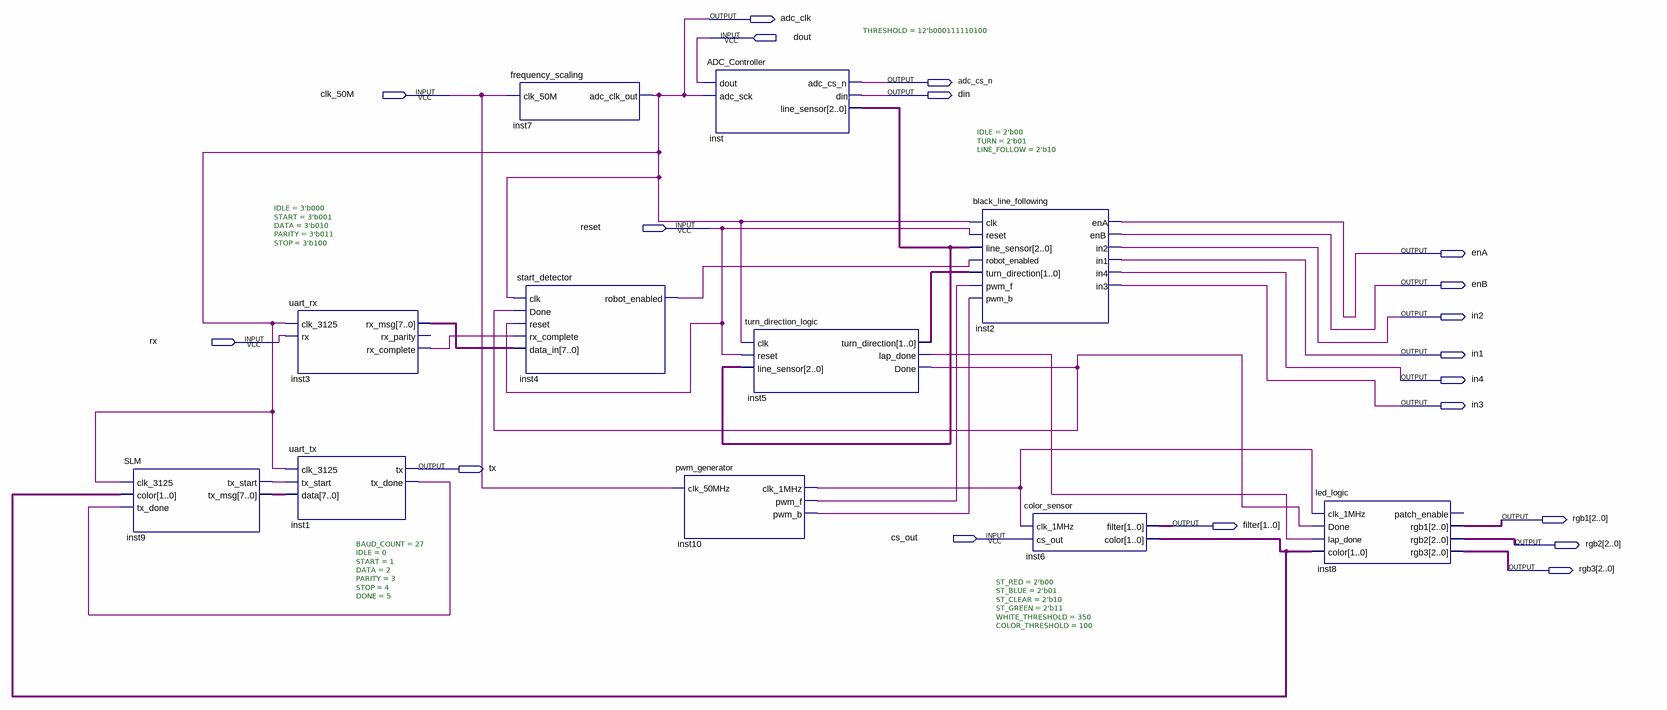
[diagram p0: schematic sheet]
// Quartus schematic top_module.bdf as structural Verilog: 11 symbols, 19 pins
module top_module (
  input  dout,
  input  clk_50M,
  input  reset,
  input  rx,
  input  cs_out,
  output adc_clk,
  output adc_cs_n,
  output din,
  output enA,
  output enB,
  output in2,
  output in1,
  output in4,
  output in3,
  output tx,
  output [2:0] rgb1,
  output [1:0] filter,
  output [2:0] rgb2,
  output [2:0] rgb3
);

  wire inst1_tx_done, inst3_rx_complete, inst4_robot_enabled, inst5_done, inst5_lap_done, inst9_tx_start,
       inst10_clk_1mhz, inst10_pwm_b, inst10_pwm_f;
  wire [1:0] inst5_turn_direction, inst6_color;
  wire [2:0] inst_line_sensor;
  wire [7:0] inst3_rx_msg, inst9_tx_msg;

  SLM inst9 (
    .clk_3125(adc_clk), .color(inst6_color), .tx_done(inst1_tx_done), .tx_start(inst9_tx_start),
    .tx_msg(inst9_tx_msg));
  uart_rx #(.IDLE(3'b000), .START(3'b001), .DATA(3'b010), .PARITY(3'b011), .STOP(3'b100)) inst3 (
    .clk_3125(adc_clk), .rx(rx), .rx_msg(inst3_rx_msg), .rx_complete(inst3_rx_complete));  // open: rx_parity
  uart_tx #(.BAUD_COUNT(27), .IDLE(0), .START(1), .DATA(2), .PARITY(3), .STOP(4), .DONE(5)) inst1 (
    .clk_3125(adc_clk), .tx_start(inst9_tx_start), .data(inst9_tx_msg), .tx(tx), .tx_done(inst1_tx_done));
  frequency_scaling inst7 (.clk_50M(clk_50M), .adc_clk_out(adc_clk));
  start_detector inst4 (
    .clk(adc_clk), .Done(inst5_done), .reset(reset), .rx_complete(inst3_rx_complete), .data_in(inst3_rx_msg),
    .robot_enabled(inst4_robot_enabled));
  pwm_generator inst10 (.clk_50MHz(clk_50M), .clk_1MHz(inst10_clk_1mhz), .pwm_f(inst10_pwm_f), .pwm_b(inst10_pwm_b));
  ADC_Controller #(.THRESHOLD(12'b000111110100)) inst (
    .dout(dout), .adc_sck(adc_clk), .adc_cs_n(adc_cs_n), .din(din), .line_sensor(inst_line_sensor));
  turn_direction_logic inst5 (
    .clk(adc_clk), .reset(reset), .line_sensor(inst_line_sensor), .turn_direction(inst5_turn_direction),
    .lap_done(inst5_lap_done), .Done(inst5_done));
  black_line_following #(.IDLE(2'b00), .TURN(2'b01), .LINE_FOLLOW(2'b10)) inst2 (
    .clk(adc_clk), .reset(reset), .line_sensor(inst_line_sensor), .robot_enabled(inst4_robot_enabled),
    .turn_direction(inst5_turn_direction), .pwm_f(inst10_pwm_f), .pwm_b(inst10_pwm_b), .enA(enA), .enB(enB),
    .in2(in2), .in1(in1), .in4(in4), .in3(in3));
  color_sensor #(.ST_RED(2'b00), .ST_BLUE(2'b01), .ST_CLEAR(2'b10), .ST_GREEN(2'b11), .WHITE_THRESHOLD(350), .COLOR_THRESHOLD(100)) inst6 (
    .clk_1MHz(inst10_clk_1mhz), .cs_out(cs_out), .filter(filter), .color(inst6_color));
  led_logic inst8 (
    .clk_1MHz(inst10_clk_1mhz), .Done(inst5_done), .lap_done(inst5_lap_done), .color(inst6_color),
    .rgb1(rgb1), .rgb2(rgb2), .rgb3(rgb3));  // open: patch_enable
endmodule
